# Altium schematic sheet 0249_GPU SPI ISOLATION .SchDoc
size 848 x 558 mm
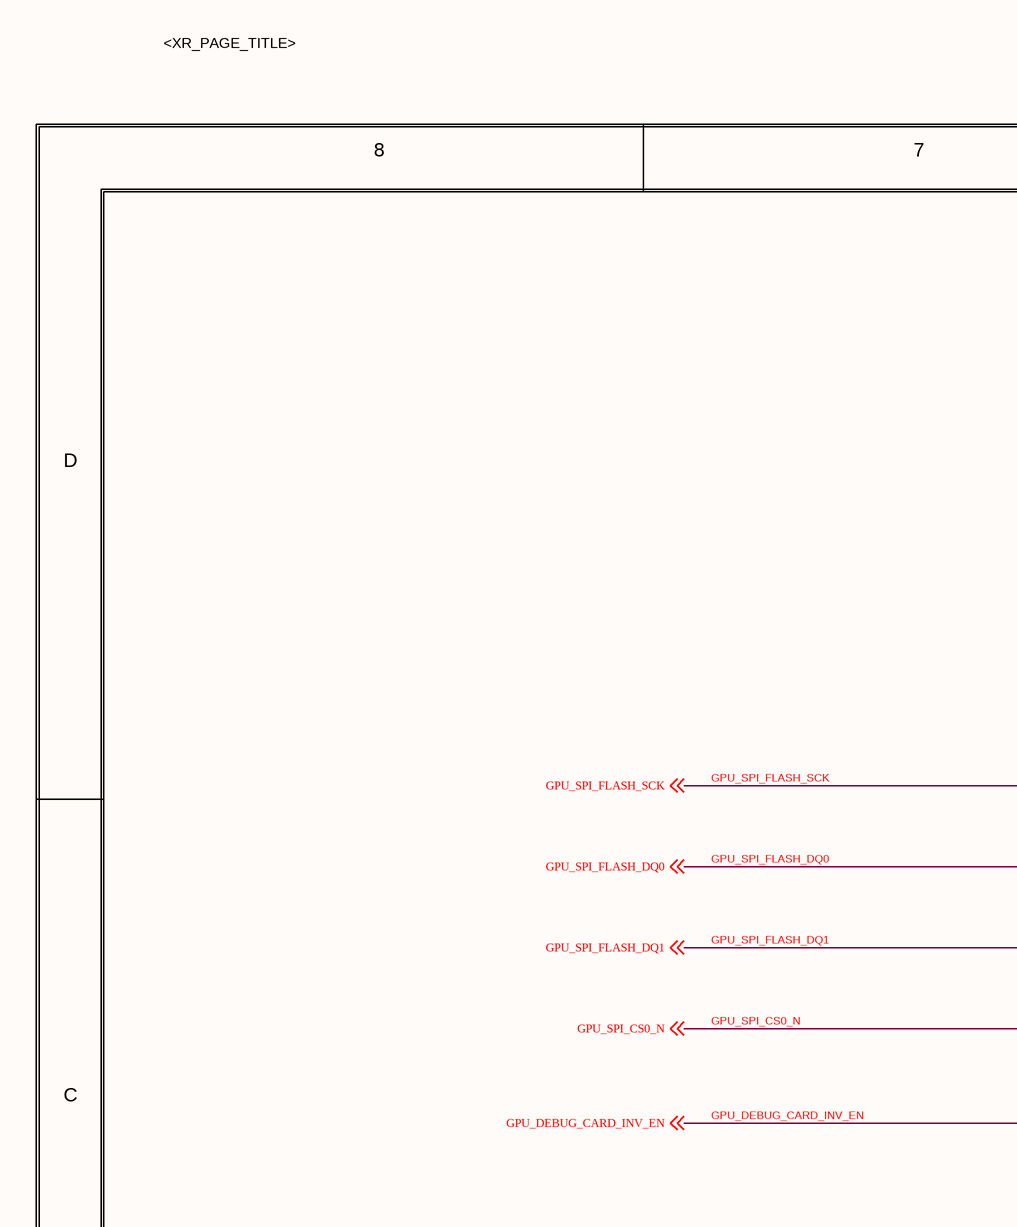
[diagram p0: 0249_GPU SPI ISOLATION .SchDoc, top left]
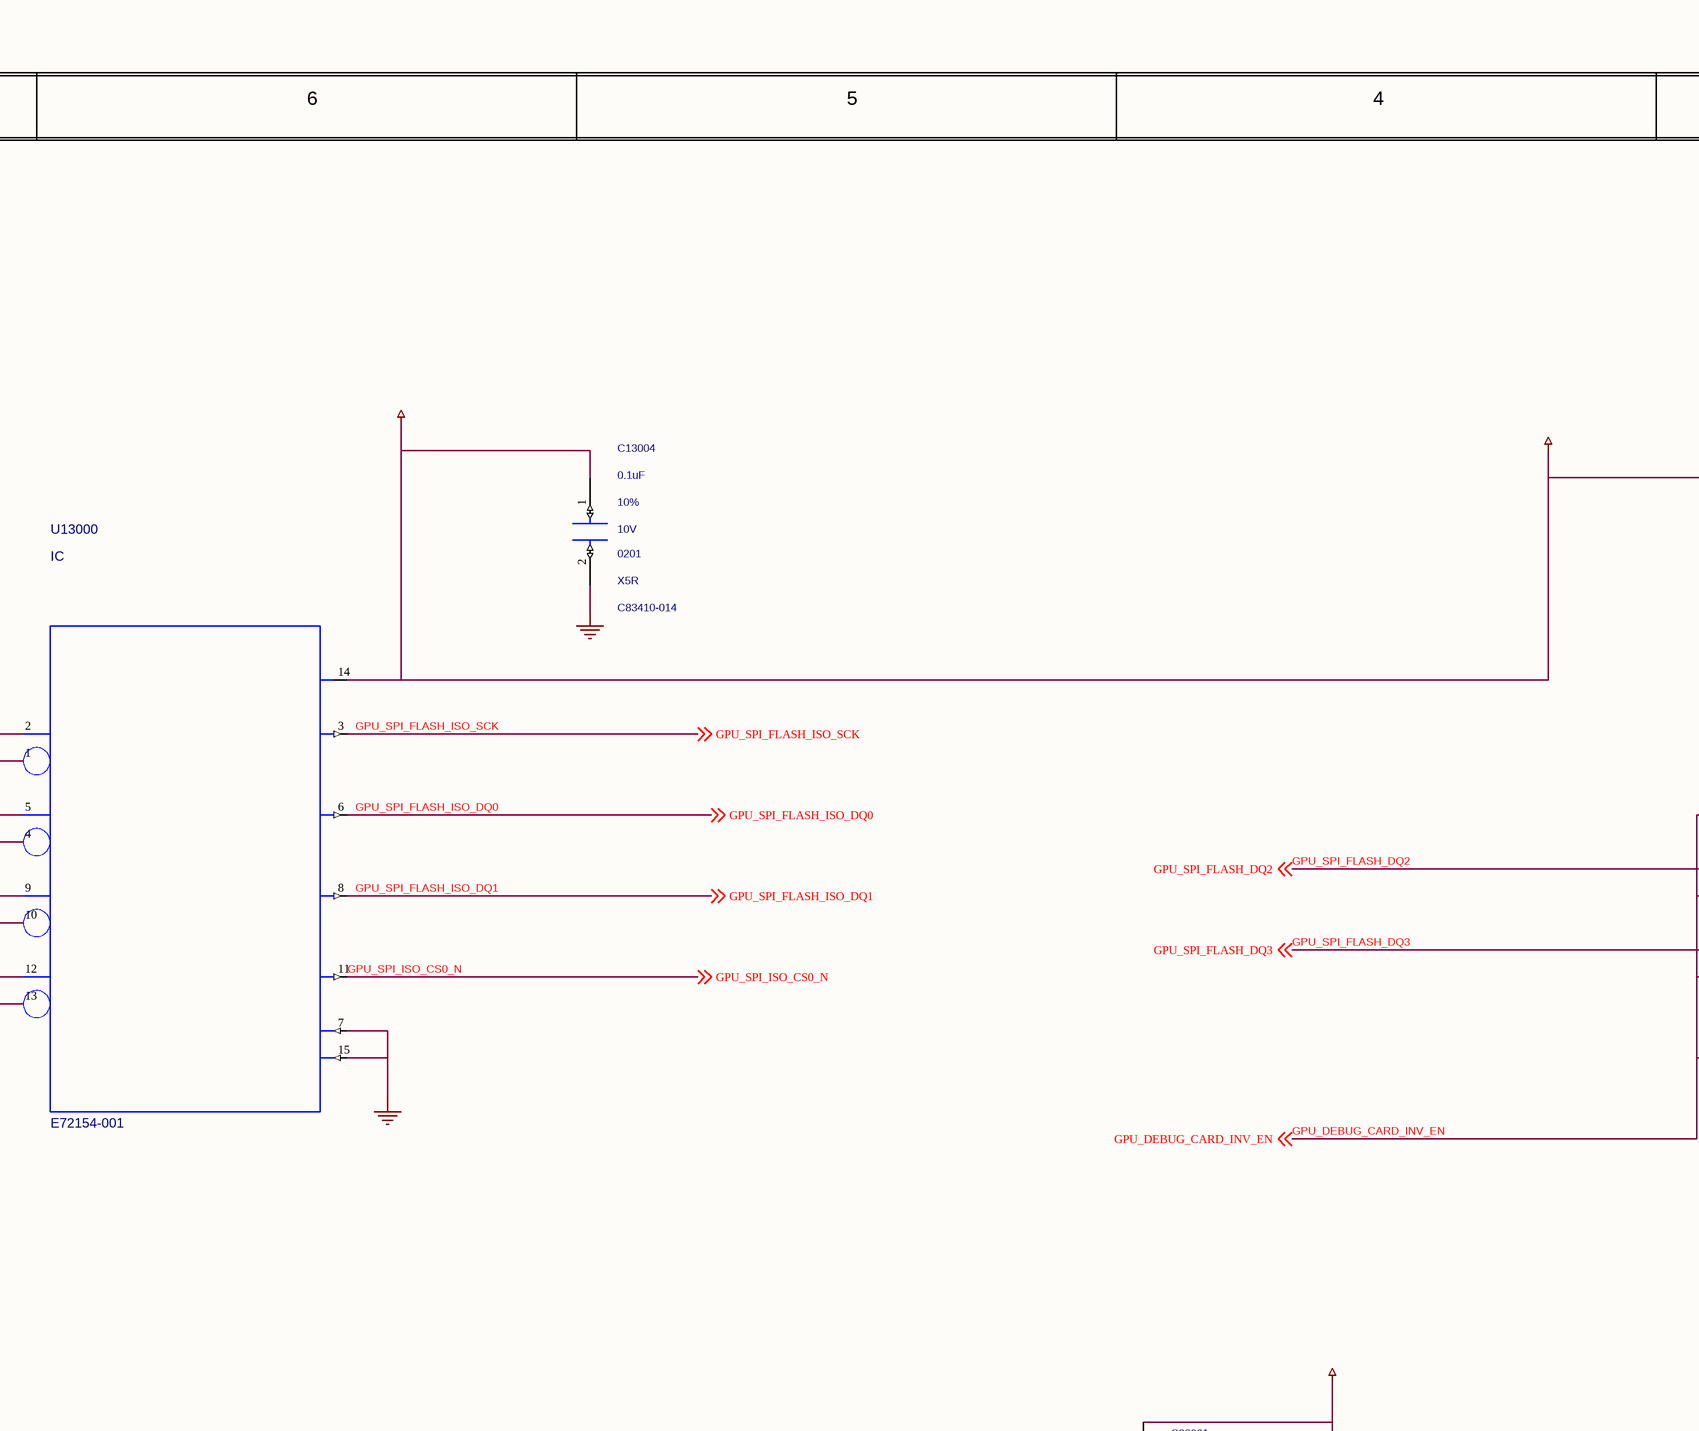
[diagram p1: 0249_GPU SPI ISOLATION .SchDoc, top middle]
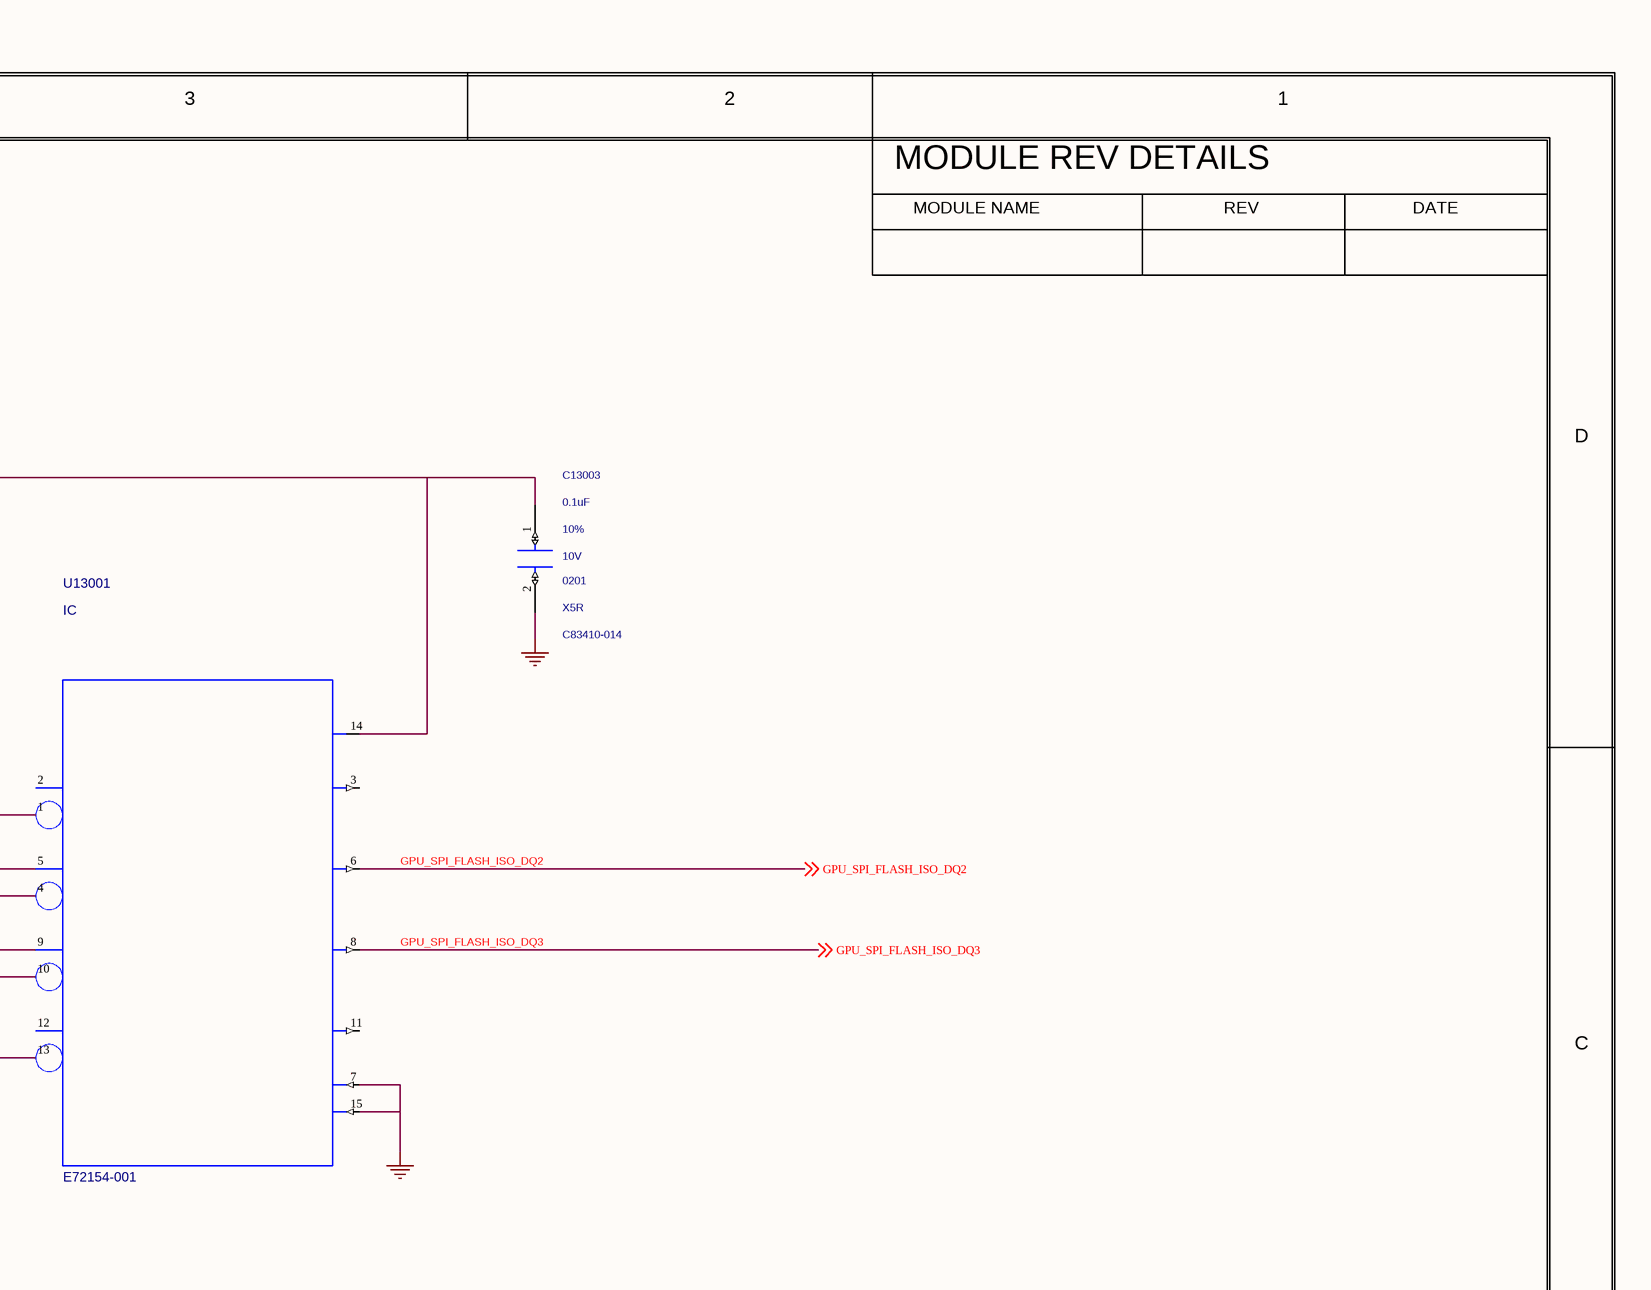
[diagram p2: 0249_GPU SPI ISOLATION .SchDoc, top right]
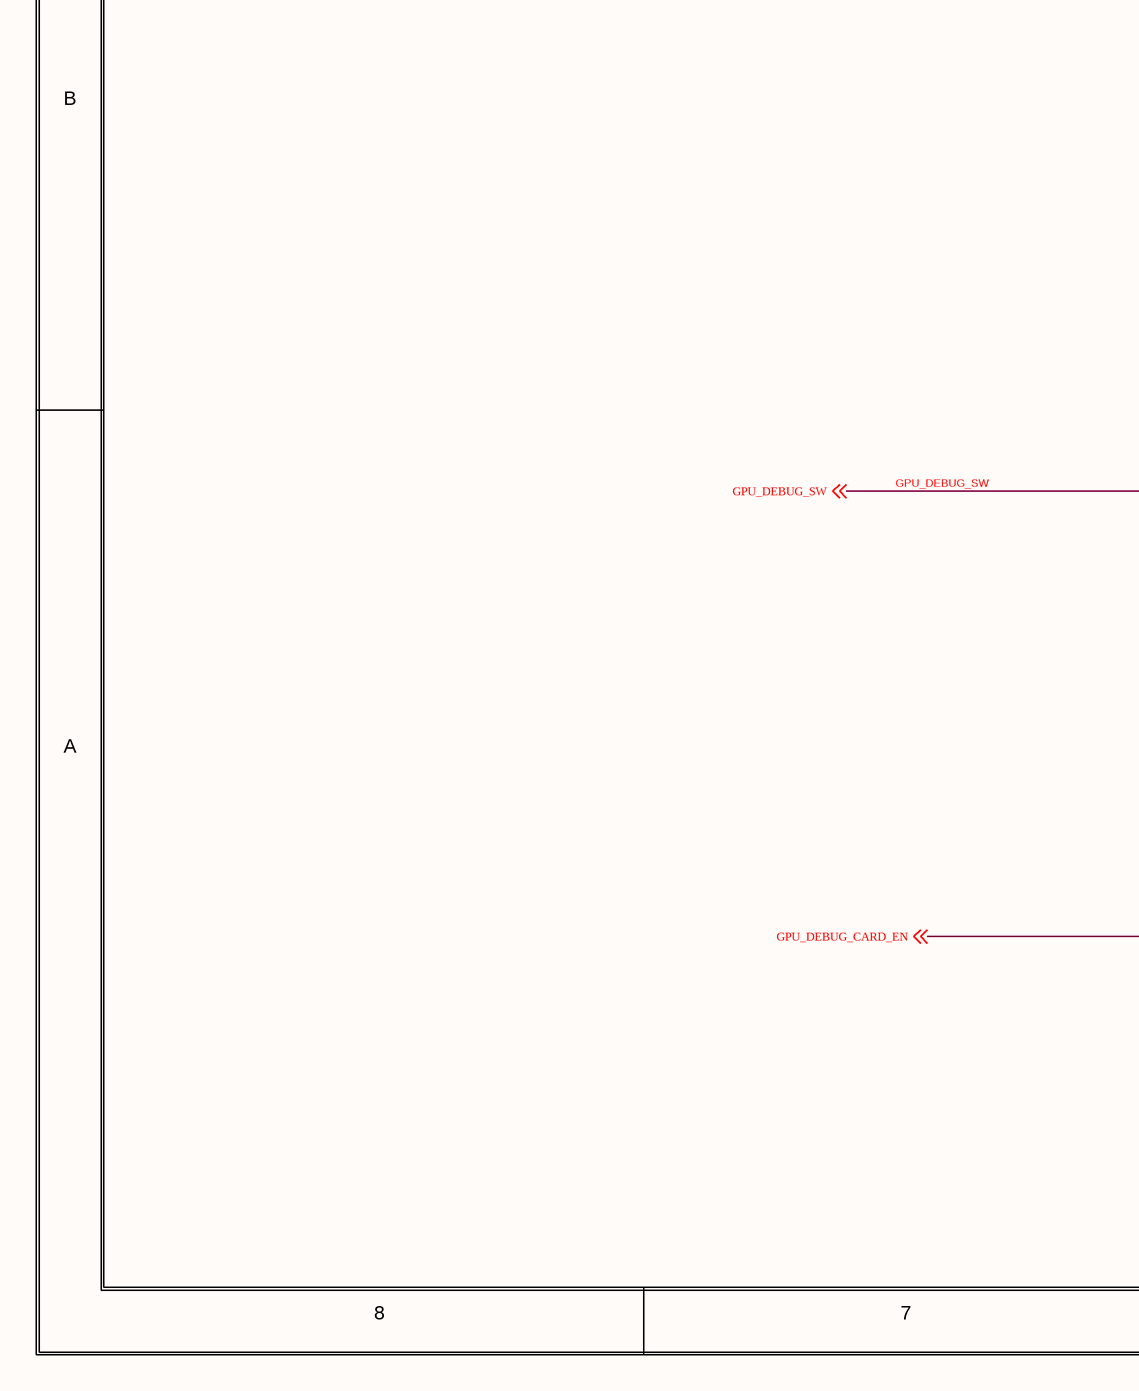
[diagram p3: 0249_GPU SPI ISOLATION .SchDoc, bottom left]
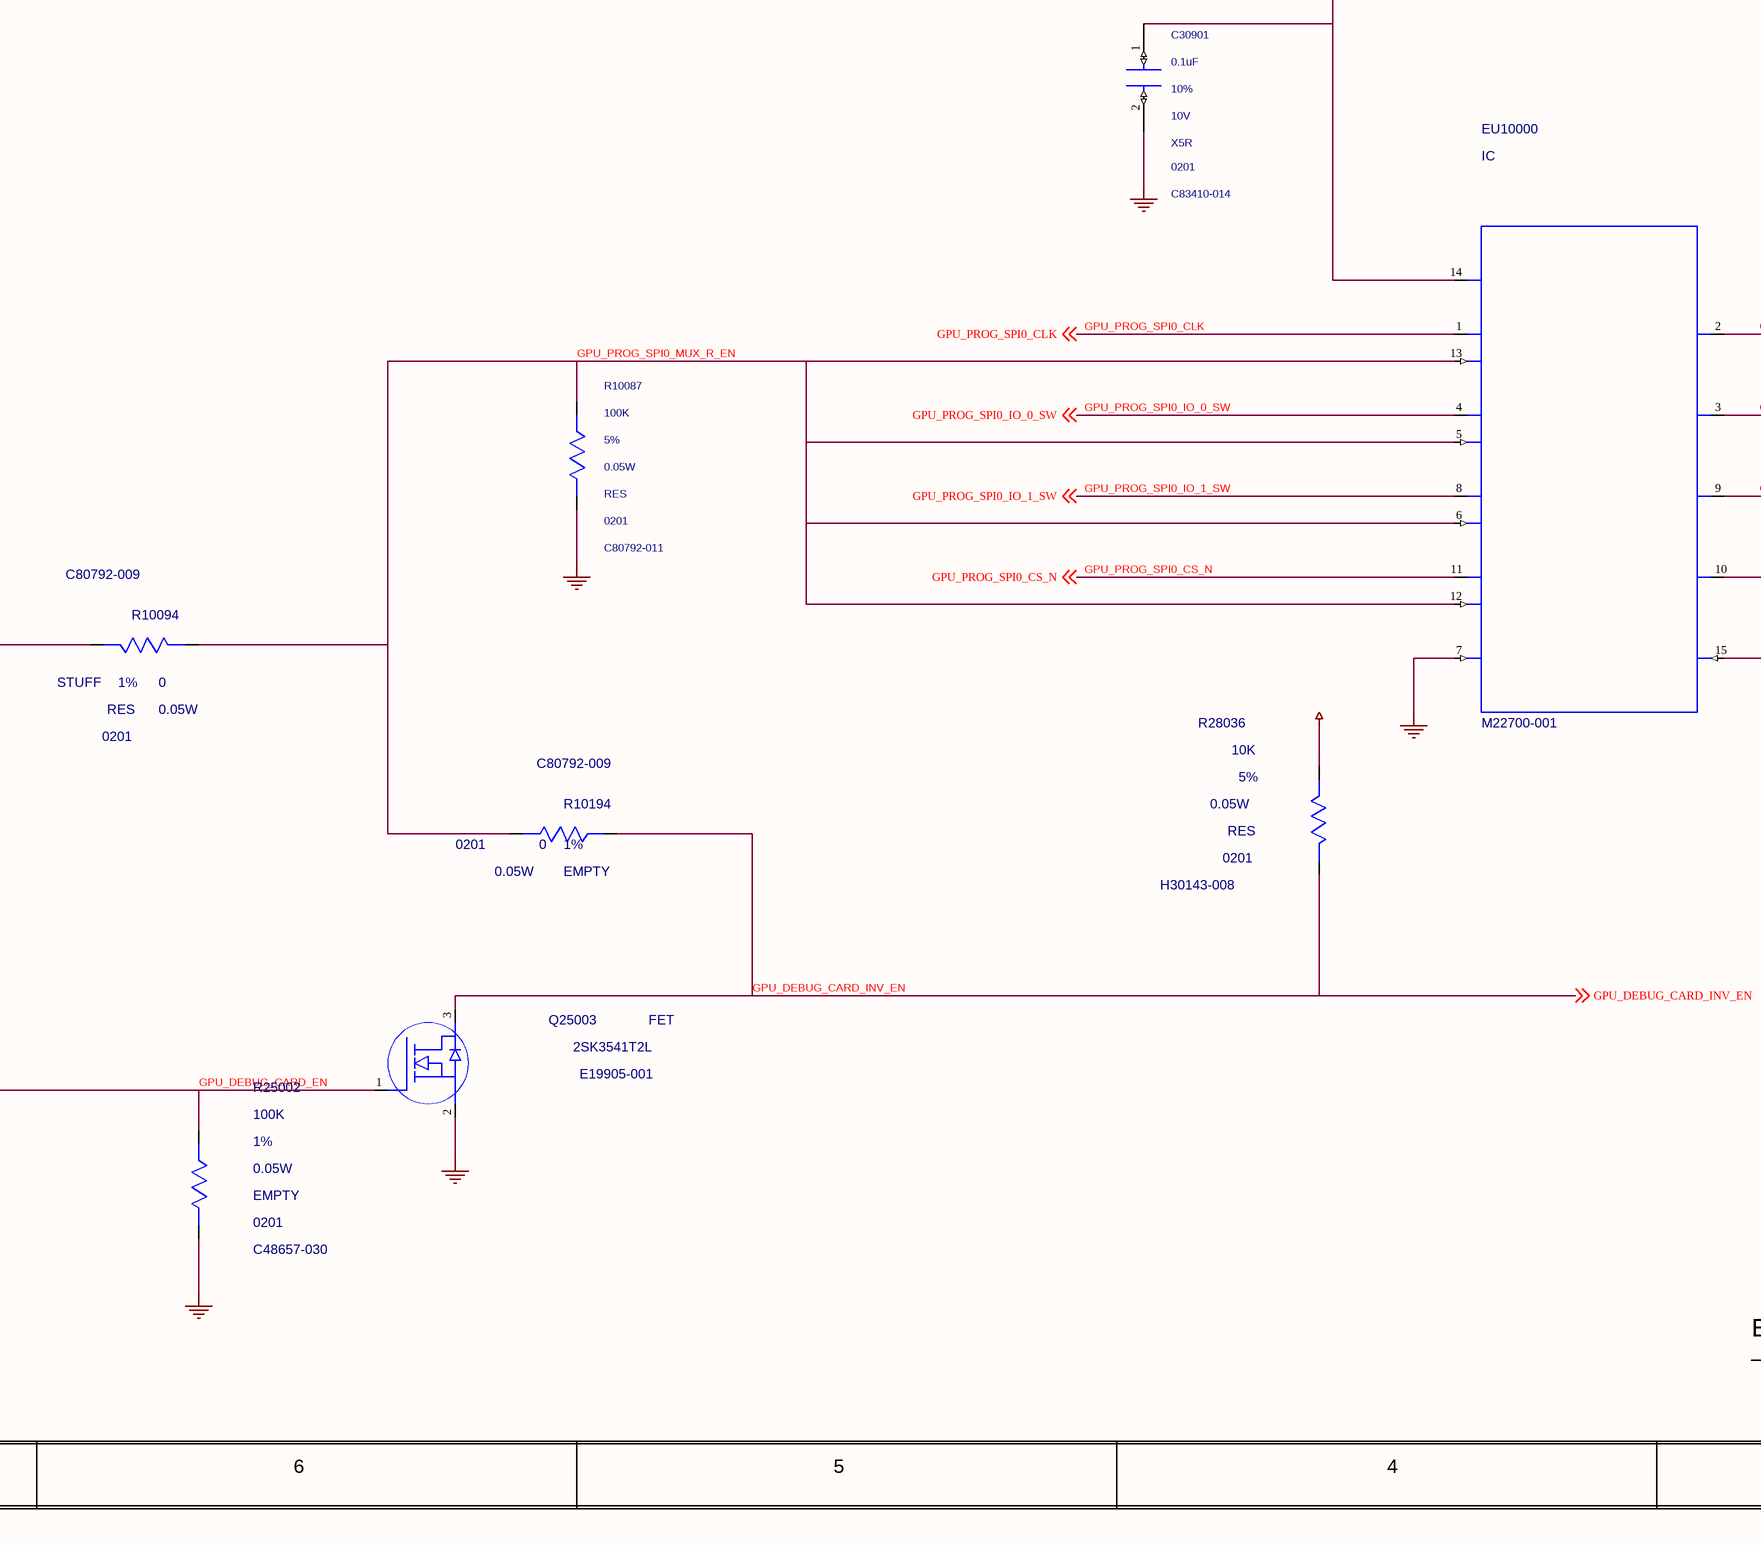
[diagram p4: 0249_GPU SPI ISOLATION .SchDoc, bottom middle]
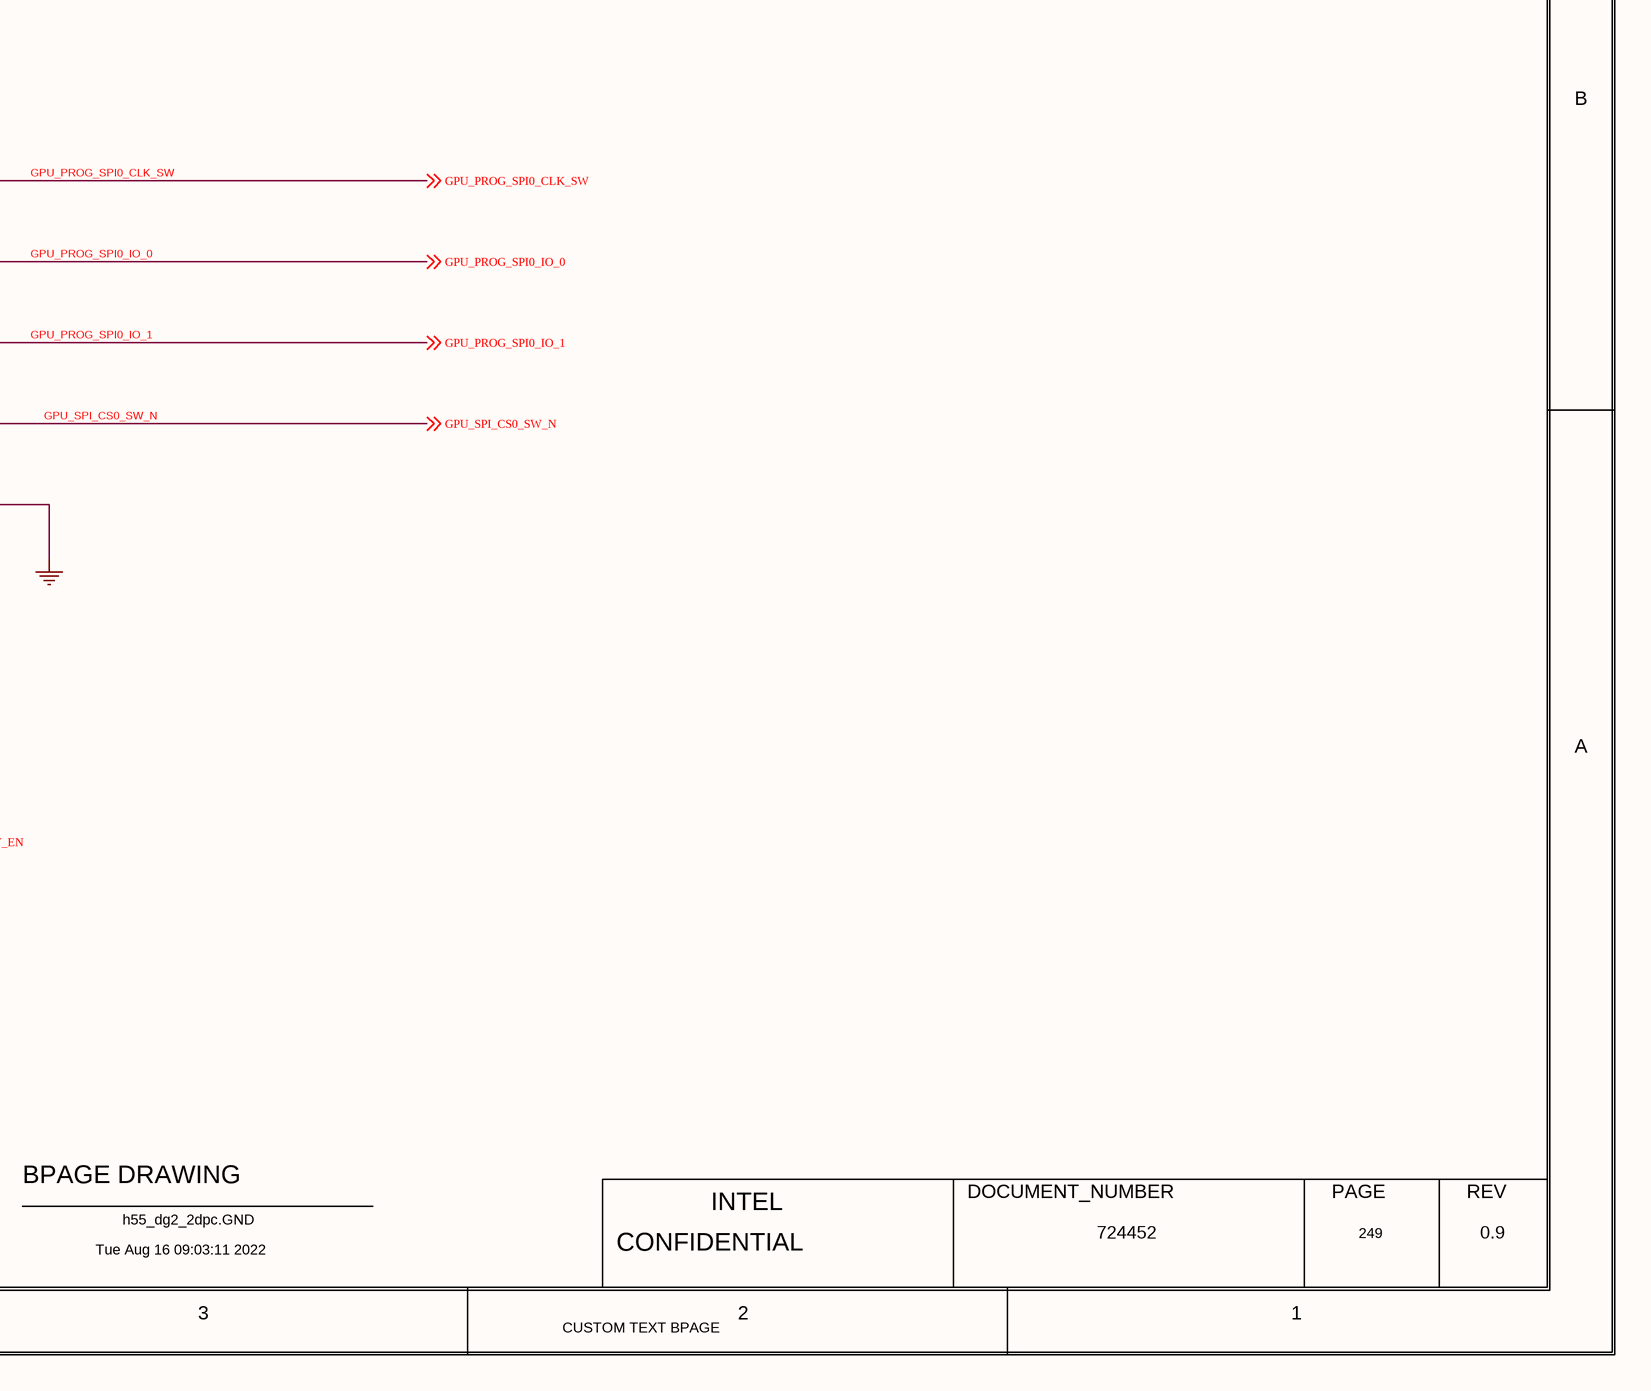
[diagram p5: 0249_GPU SPI ISOLATION .SchDoc, bottom right]

## Parts
C13003  0.1uF  MATERIAL: X5R  PACK_TYPE: 0201  PART_NUMBER: C83410-014  TOLERANCE: 10%  VOLTAGE: 10V  [SMC0201IA]
C13004  0.1uF  MATERIAL: X5R  PACK_TYPE: 0201  PART_NUMBER: C83410-014  TOLERANCE: 10%  VOLTAGE: 10V  [SMC0201IA]
C30901  0.1uF  MATERIAL: X5R  PACK_TYPE: 0201  PART_NUMBER: C83410-014  TOLERANCE: 10%  VOLTAGE: 10V  [SMC0201IA]
EU10000  MATERIAL: IC  PART_NUMBER: M22700-001  [CTK0_LCC14_2600X3100_500_DF1000X1500_MA]  (hidden comment: C_TTL4066)
Q25003  2SK3541T2L  MATERIAL: FET  PART_NUMBER: E19905-001  [SOT723MA]
R10087  100K  MATERIAL: RES  PACK_TYPE: 0201  PART_NUMBER: C80792-011  TOLERANCE: 5%  WATTAGE: 0.05W  [CTK0_SM0201_630X330_MA]
R10094  0  BOM_USE: STUFF  MATERIAL: RES  PACK_TYPE: 0201  PART_NUMBER: C80792-009  TOLERANCE: 1%  WATTAGE: 0.05W  [TK0_SM0201_630X330_MC]
R10194  0  MATERIAL: EMPTY  PACK_TYPE: 0201  PART_NUMBER: C80792-009  TOLERANCE: 1%  WATTAGE: 0.05W  [TK0_SM0201_630X330_MC]
R25002  100K  MATERIAL: EMPTY  PACK_TYPE: 0201  PART_NUMBER: C48657-030  TOLERANCE: 1%  WATTAGE: 0.05W  [CTK0_SM0201_630X330_MA]
R28036  10K  MATERIAL: RES  PACK_TYPE: 0201  PART_NUMBER: H30143-008  TOLERANCE: 5%  WATTAGE: 0.05W  [CTK0_SM0201_630X330_MA]
U13000  MATERIAL: IC  PART_NUMBER: E72154-001  [CTK2_LCC14_S3650_500_DFS2050_MA]  (hidden comment: C_SN74CBT3125)
U13001  MATERIAL: IC  PART_NUMBER: E72154-001  [CTK2_LCC14_S3650_500_DFS2050_MA]  (hidden comment: C_SN74CBT3125)

## Nets
+V1P8A_SPI: C30901.1(A) EU10000.14(VCC)
+V3P3A: R28036.1(A)
+V5S_GPU: C13003.1(A) C13004.1(A) U13000.14(VCC) U13001.14(VCC)
GND: C13003.2(B) C13004.2(B) C30901.2(B) EU10000.7(GND) EU10000.15(GND_TPD) Q25003.2(SRC) R10087.2(B) R25002.2(B) U13000.7(GND) U13000.15(THPAD) U13001.7(GND) U13001.15(THPAD)
GPU_DEBUG_CARD_EN: Q25003.1(GATE) R25002.1(A) ; off-sheet GPU_DEBUG_CARD_EN
GPU_DEBUG_CARD_INV_EN: Q25003.3(DRN) R10194.2(B) R28036.2(B) U13000.1(1OE_N) U13000.4(2OE_N) U13000.10(3OE_N) U13000.13(4OE_N) U13001.1(1OE_N) U13001.4(2OE_N) U13001.10(3OE_N) U13001.13(4OE_N) ; off-sheet GPU_DEBUG_CARD_INV_EN
GPU_DEBUG_SW: R10094.2(B) ; off-sheet GPU_DEBUG_SW
GPU_PROG_SPI0_CLK: EU10000.1(1Y) ; off-sheet GPU_PROG_SPI0_CLK
GPU_PROG_SPI0_CLK_SW: EU10000.2(1Z) ; off-sheet GPU_PROG_SPI0_CLK_SW
GPU_PROG_SPI0_CS_N: EU10000.11(4Y) ; off-sheet GPU_PROG_SPI0_CS_N
GPU_PROG_SPI0_IO_0: EU10000.3(2Z) ; off-sheet GPU_PROG_SPI0_IO_0
GPU_PROG_SPI0_IO_0_SW: EU10000.4(2Y) ; off-sheet GPU_PROG_SPI0_IO_0_SW
GPU_PROG_SPI0_IO_1: EU10000.9(3Z) ; off-sheet GPU_PROG_SPI0_IO_1
GPU_PROG_SPI0_IO_1_SW: EU10000.8(3Y) ; off-sheet GPU_PROG_SPI0_IO_1_SW
GPU_PROG_SPI0_MUX_R_EN: EU10000.5(2E) EU10000.6(3E) EU10000.12(4E) EU10000.13(1E) R10087.1(A) R10094.1(A) R10194.1(A)
GPU_SPI_CS0_N: U13000.12(4A) ; off-sheet GPU_SPI_CS0_N
GPU_SPI_CS0_SW_N: EU10000.10(4Z) ; off-sheet GPU_SPI_CS0_SW_N
GPU_SPI_FLASH_DQ0: U13000.5(2A) ; off-sheet GPU_SPI_FLASH_DQ0
GPU_SPI_FLASH_DQ1: U13000.9(3A) ; off-sheet GPU_SPI_FLASH_DQ1
GPU_SPI_FLASH_DQ2: U13001.5(2A) ; off-sheet GPU_SPI_FLASH_DQ2
GPU_SPI_FLASH_DQ3: U13001.9(3A) ; off-sheet GPU_SPI_FLASH_DQ3
GPU_SPI_FLASH_ISO_DQ0: U13000.6(2B) ; off-sheet GPU_SPI_FLASH_ISO_DQ0
GPU_SPI_FLASH_ISO_DQ1: U13000.8(3B) ; off-sheet GPU_SPI_FLASH_ISO_DQ1
GPU_SPI_FLASH_ISO_DQ2: U13001.6(2B) ; off-sheet GPU_SPI_FLASH_ISO_DQ2
GPU_SPI_FLASH_ISO_DQ3: U13001.8(3B) ; off-sheet GPU_SPI_FLASH_ISO_DQ3
GPU_SPI_FLASH_ISO_SCK: U13000.3(1B) ; off-sheet GPU_SPI_FLASH_ISO_SCK
GPU_SPI_FLASH_SCK: U13000.2(1A) ; off-sheet GPU_SPI_FLASH_SCK
GPU_SPI_ISO_CS0_N: U13000.11(4B) ; off-sheet GPU_SPI_ISO_CS0_N

Not connected (* = marked no-connect by the designer): U13001 2(1A) 3(1B) 11(4B) 12(4A)

## Notes on the sheet
- <XR_PAGE_TITLE>
- 8
- 7
- 6
- 5
- 4
- 3
- 2
- 1
- MODULE REV DETAILS
- MODULE NAME
- REV
- DATE
- D
- C
- B
- A
- BPAGE DRAWING
- INTEL
- DOCUMENT_NUMBER
- PAGE
- Tue Aug 16 09:03:11 2022
- h55_dg2_2dpc.GND
- CONFIDENTIAL
- 724452
- 249
- 0.9
- CUSTOM TEXT BPAGE

## Library data of the parts
C13003 = CAP: CDS_PHYS_PART_NAME: CAP_0201-C83410-014,X5R,0.1UF,10V,10%,LPDB,GENERIC; OriginalSymbolOrigin: (-50,25); XY: (5375,3550); VER: 1; SUB_ROOM_2: PLACEHOLDER; SUB_ROOM_1: BOOT_FLASH_AP; ROT: 0; PHYS_PAGE: 249; LOCATION: C13003; DRAWING: @RVP1_ADL_SB_ADP_S_DDR5_SODIMM_2DPC_LIB.H55_DG2_2DPC(SCH_1):PAGE585; CDS_LIB: discrete; PCB Footprint: SMC0201IA; CHIPS_PART_NAME: CAP; CDS_PART_NAME: CAP_0201-C83410-014,X5R,0.1UF,10V,10%,LPDB,GENERIC; CDS_LOCATION: C13003
C13004 = CAP: CDS_PHYS_PART_NAME: CAP_0201-C83410-014,X5R,0.1UF,10V,10%,LPDB,GENERIC; OriginalSymbolOrigin: (-50,25); XY: (2275,3600); VER: 1; SUB_ROOM_2: PLACEHOLDER; SUB_ROOM_1: BOOT_FLASH_AP; ROT: 0; PHYS_PAGE: 249; LOCATION: C13004; DRAWING: @RVP1_ADL_SB_ADP_S_DDR5_SODIMM_2DPC_LIB.H55_DG2_2DPC(SCH_1):PAGE585; CDS_LIB: discrete; PCB Footprint: SMC0201IA; CHIPS_PART_NAME: CAP; CDS_PART_NAME: CAP_0201-C83410-014,X5R,0.1UF,10V,10%,LPDB,GENERIC; CDS_LOCATION: C13004
C30901 = CAP: CDS_PHYS_PART_NAME: CAP_0201-C83410-014,X5R,0.1UF,10V,10%,LPDB,GENERIC; OriginalSymbolOrigin: (-50,25); XY: (3300,1850); VER: 1; SUB_ROOM2: DECAP; SUB_ROOM: SPI_FLASH; ROT: 0; PHYS_PAGE: 249; LOCATION: C30901; DRAWING: @RVP1_ADL_SB_ADP_S_DDR5_SODIMM_2DPC_LIB.H55_DG2_2DPC(SCH_1):PAGE585; CDS_LIB: discrete; PCB Footprint: SMC0201IA; CHIPS_PART_NAME: CAP; CDS_PART_NAME: CAP_0201-C83410-014,X5R,0.1UF,10V,10%,LPDB,GENERIC; CDS_LOCATION: C30901
EU10000 = C_TTL4066: CDS_PHYS_PART_NAME: C_TTL4066_LCC-M22700-001,IC,74LVC4066BQ,TK0,GENERIC; CDS_LMAN_SYM_OUTLINE: -200,450,200,-450; FP_TECH: TK0; IP: GENERIC; PACK_TYPE: LCC; ROOM: NONE; OriginalSymbolOrigin: (-225,450); XY: (4125,1125); VER: 2; ROT: 0; PHYS_PAGE: 249; LOCATION: EU10000; DRAWING: @RVP1_ADL_SB_ADP_S_DDR5_SODIMM_2DPC_LIB.H55_DG2_2DPC(SCH_1):PAGE585; CDS_LIB: local; VARIANT: ?; PCB Footprint: CTK0_LCC14_2600X3100_500_DF1000X1500_MA; CHIPS_PART_NAME: C_TTL4066; CDS_PART_NAME: C_TTL4066_LCC-M22700-001,IC,74LVC4066BQ,TK0,GENERIC; CDS_LOCATION: EU10000
Q25003 = MOSFET_N#1: CDS_PHYS_PART_NAME: MOSFET_N_SOT723-E19905-001,FET,2SK3541T2L,LPDB,GENERIC; CDS_LMAN_SYM_OUTLINE: -100,100,100,-100; PACK_TYPE: SOT723; OriginalSymbolOrigin: (-75,75); XY: (1975,25); VER: 4; ROT: 2; PHYS_PAGE: 249; LOCATION: Q25003; IP: GENERIC; FP_TECH: LPDB; DRAWING: @RVP1_ADL_SB_ADP_S_DDR5_SODIMM_2DPC_LIB.H55_DG2_2DPC(SCH_1):PAGE585; CDS_LIB: discrete; PCB Footprint: SOT723MA; SEC_TYPE: SOT723; CHIPS_PART_NAME: MOSFET_N; CDS_PART_NAME: MOSFET_N_SOT723-E19905-001,FET,2SK3541T2L,LPDB,GENERIC; CDS_LOCATION: Q25003
R10087 = C_RES: CDS_PHYS_PART_NAME: C_RES_0201-C80792-011,RES,100K,5%,0.05W,TK0,GENERIC; CDS_LMAN_SYM_OUTLINE: -50,50,50,-50; FP_TECH: TK0; IP: GENERIC; ROOM: NONE; OriginalSymbolOrigin: (-25,75); XY: (2250,1150); VER: 2; ROT: 0; PHYS_PAGE: 249; LOCATION: R10087; DRAWING: @RVP1_ADL_SB_ADP_S_DDR5_SODIMM_2DPC_LIB.H55_DG2_2DPC(SCH_1):PAGE585; CDS_LIB: c_discrete; VARIANT: ?; PCB Footprint: CTK0_SM0201_630X330_MA; CHIPS_PART_NAME: C_RES; CDS_PART_NAME: C_RES_0201-C80792-011,RES,100K,5%,0.05W,TK0,GENERIC; CDS_LOCATION: R10087
R10094 = RES_2#1: CHIPS_PART_NAME: RES_2; CDS_PHYS_PART_NAME: RES_2_0201-C80792-009,RES,0,1%,0.05W,TK0,GENERIC; CDS_LMAN_SYM_OUTLINE: -50,50,50,-50; FP_TECH: TK0; IP: GENERIC; ROOM: NONE; OriginalSymbolOrigin: (-75,25); XY: (1450,800); VER: 1; ROT: 2; PHYS_PAGE: 249; LOCATION: R10094; DRAWING: @RVP1_ADL_SB_ADP_S_DDR5_SODIMM_2DPC_LIB.H55_DG2_2DPC(SCH_1):PAGE585; CDS_LIB: discrete_2; VARIANT: ?; PCB Footprint: TK0_SM0201_630X330_MC; CDS_PART_NAME: RES_2_0201-C80792-009,RES,0,1%,0.05W,TK0,GENERIC; CDS_LOCATION: R10094
R10194 = RES_2#1: CHIPS_PART_NAME: RES_2; CDS_PHYS_PART_NAME: RES_2_0201-C80792-009,EMPTY,0,1%,0.05W,TK0,GENERIC; BOM_USE: STUFF; CDS_LMAN_SYM_OUTLINE: -50,50,50,-50; FP_TECH: TK0; IP: GENERIC; ROOM: NONE; OriginalSymbolOrigin: (-75,25); XY: (2225,450); VER: 1; PHYS_PAGE: 249; LOCATION: R10194; DRAWING: @RVP1_ADL_SB_ADP_S_DDR5_SODIMM_2DPC_LIB.H55_DG2_2DPC(SCH_1):PAGE585; CDS_LIB: discrete_2; VARIANT: ?; PCB Footprint: TK0_SM0201_630X330_MC; ROT: 0; CDS_PART_NAME: RES_2_0201-C80792-009,EMPTY,0,1%,0.05W,TK0,GENERIC; CDS_LOCATION: R10194
R25002 = C_RES: CDS_PHYS_PART_NAME: C_RES_0201-C48657-030,EMPTY,100K,1%,0.05W,TK0,GENERIC; CDS_LMAN_SYM_OUTLINE: -50,50,50,-50; FP_TECH: TK0; IP: GENERIC; ROOM: NONE; OriginalSymbolOrigin: (-25,75); XY: (1550,-200); VER: 2; ROT: 0; PHYS_PAGE: 249; LOCATION: R25002; DRAWING: @RVP1_ADL_SB_ADP_S_DDR5_SODIMM_2DPC_LIB.H55_DG2_2DPC(SCH_1):PAGE585; CDS_LIB: c_discrete; VARIANT: ?; PCB Footprint: CTK0_SM0201_630X330_MA; CHIPS_PART_NAME: C_RES; CDS_PART_NAME: C_RES_0201-C48657-030,EMPTY,100K,1%,0.05W,TK0,GENERIC; CDS_LOCATION: R25002
R28036 = C_RES: CDS_PHYS_PART_NAME: C_RES_0201-H30143-008,RES,10K,5%,0.05W,TK0,GENERIC; CDS_LMAN_SYM_OUTLINE: -50,50,50,-50; FP_TECH: TK0; IP: GENERIC; ROOM: NONE; OriginalSymbolOrigin: (-25,75); XY: (3625,475); VER: 2; PHYS_PAGE: 249; LOCATION: R28036; DRAWING: @RVP1_ADL_SB_ADP_S_DDR5_SODIMM_2DPC_LIB.H55_DG2_2DPC(SCH_1):PAGE585; CDS_LIB: c_discrete; VARIANT: ?; PCB Footprint: CTK0_SM0201_630X330_MA; ROT: 2; CHIPS_PART_NAME: C_RES; CDS_PART_NAME: C_RES_0201-H30143-008,RES,10K,5%,0.05W,TK0,GENERIC; CDS_LOCATION: R28036
U13000 = C_SN74CBT3125: CDS_PHYS_PART_NAME: C_SN74CBT3125_LCC-E72154-001,IC,SN74CBT3125RGYR,TK2,GENERIC; CDS_LMAN_SYM_OUTLINE: -250,450,250,-450; FP_TECH: TK2; IP: GENERIC; PACK_TYPE: LCC; ROOM: NONE; OriginalSymbolOrigin: (-300,450); XY: (1525,2975); VER: 2; ROT: 0; PHYS_PAGE: 249; LOCATION: U13000; DRAWING: @RVP1_ADL_SB_ADP_S_DDR5_SODIMM_2DPC_LIB.H55_DG2_2DPC(SCH_1):PAGE585; CDS_LIB: local; VARIANT: ?; PCB Footprint: CTK2_LCC14_S3650_500_DFS2050_MA; CHIPS_PART_NAME: C_SN74CBT3125; CDS_PART_NAME: C_SN74CBT3125_LCC-E72154-001,IC,SN74CBT3125RGYR,TK2,GENERIC; CDS_LOCATION: U13000
U13001 = C_SN74CBT3125: CDS_PHYS_PART_NAME: C_SN74CBT3125_LCC-E72154-001,IC,SN74CBT3125RGYR,TK2,GENERIC; CDS_LMAN_SYM_OUTLINE: -250,450,250,-450; FP_TECH: TK2; IP: GENERIC; PACK_TYPE: LCC; ROOM: NONE; OriginalSymbolOrigin: (-300,450); XY: (4750,2875); VER: 2; ROT: 0; PHYS_PAGE: 249; LOCATION: U13001; DRAWING: @RVP1_ADL_SB_ADP_S_DDR5_SODIMM_2DPC_LIB.H55_DG2_2DPC(SCH_1):PAGE585; CDS_LIB: local; VARIANT: ?; PCB Footprint: CTK2_LCC14_S3650_500_DFS2050_MA; CHIPS_PART_NAME: C_SN74CBT3125; CDS_PART_NAME: C_SN74CBT3125_LCC-E72154-001,IC,SN74CBT3125RGYR,TK2,GENERIC; CDS_LOCATION: U13001